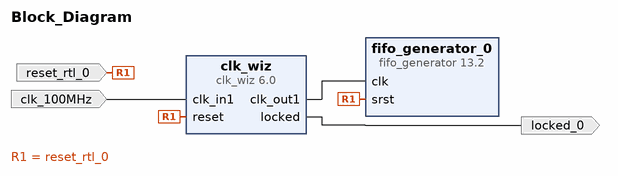
[diagram p0: block diagram of the top level]
# Vivado block design Block_Diagram, xc7k70tfbv676-1, Vivado 2024.2
create_bd_design Block_Diagram

create_bd_port -dir I -type rst reset_rtl_0
set_property -dict {CONFIG.POLARITY ACTIVE_LOW} [get_bd_ports reset_rtl_0]
create_bd_port -dir I -type clk clk_100MHz
set_property -dict {CONFIG.FREQ_HZ 100000000} [get_bd_ports clk_100MHz]
create_bd_port -dir O locked_0

create_bd_cell -type ip -vlnv xilinx.com:ip:fifo_generator:13.2 fifo_generator_0
create_bd_cell -type ip -vlnv xilinx.com:ip:clk_wiz:6.0 clk_wiz
set_property -dict {CONFIG.CLKOUT1_REQUESTED_OUT_FREQ 100.0} [get_bd_cells clk_wiz]

# ---- connections ----

connect_bd_net [get_bd_ports clk_100MHz] [get_bd_pins clk_wiz/clk_in1]
connect_bd_net [get_bd_pins clk_wiz/clk_out1] [get_bd_pins fifo_generator_0/clk]
connect_bd_net [get_bd_pins clk_wiz/locked] [get_bd_ports locked_0]
connect_bd_net -net reset_rtl_0_1 [get_bd_ports reset_rtl_0] [get_bd_pins fifo_generator_0/srst] [get_bd_pins clk_wiz/reset]

validate_bd_design
save_bd_design
